# EAGLE design controller-board (EAGLE 7.1.0)
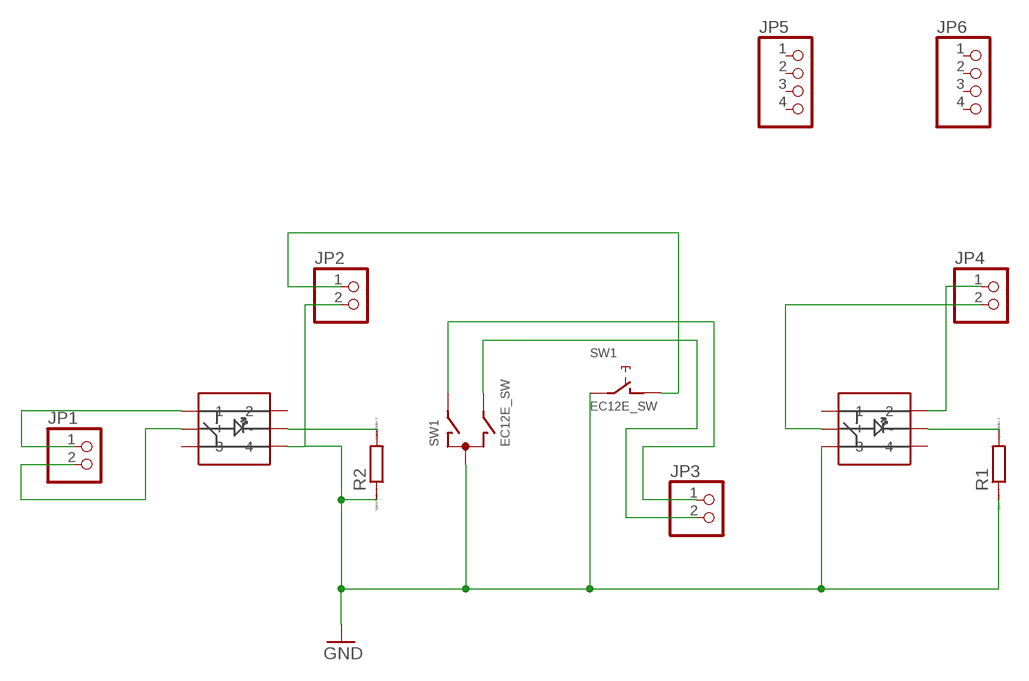
[diagram p0: schematic, sheet 1]

## Parts
BTN_MODE  PB614  [PB614]
BTN_OFF  PB614  [PB614]
JP1  PINHD-1X2  [1X02]
JP2  PINHD-1X2  [1X02]
JP3  PINHD-1X2  [1X02]
JP4  PINHD-1X2  [1X02]
JP5  PINHD-1X4  [1X04]
JP6  PINHD-1X4  [1X04]
R1  R-EU_R1206  [R1206]
R2  R-EU_R1206  [R1206]
SW1  EC12E_SW  [ALPS_EC12E_SW]

## Nets
GND: BTN_MODE.4 BTN_OFF.3 JP2.2 R1.1 R2.1 SW1.C SW1.E
LED_MODE: BTN_MODE.L+(+) JP1.2
N$1: BTN_MODE.L-(-) R2.2
N$2: BTN_OFF.L-(-) R1.2
N$3: JP2.1 SW1.D
N$4: JP3.2 SW1.B
N$5: JP3.1 SW1.A
N$6: BTN_OFF.L+(+) JP4.2
N$7: BTN_OFF.2 JP4.1
SW_MODE: BTN_MODE.1 JP1.1
Unconnected: BTN_MODE.2 BTN_MODE.3 BTN_OFF.1 BTN_OFF.4 JP5.1 JP5.2 JP5.3 JP5.4 JP6.1 JP6.2 JP6.3 JP6.4

## Library data of the parts
BTN_MODE BTN_OFF = RSJ-PB614:PB614
JP1-JP4 = pinhead:PINHD-1X2: PIN HEADER
JP5 JP6 = pinhead:PINHD-1X4: PIN HEADER
R1 R2 = resistor:R-EU_: RESISTOR, European symbol; SPICEPREFIX: R
SW1 = switch-alps:EC12E_SW: ALPS rotary Encoder EC12E series with switch; MPN: EC12E2424407; OC_FARNELL: 1520813; OC_NEWARK: 74M1068

## Board
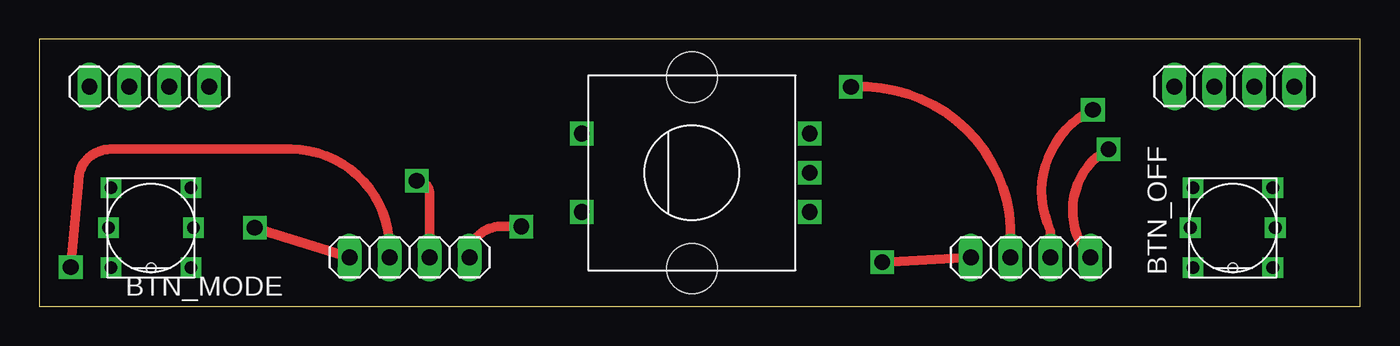
[diagram p1: board, top side]
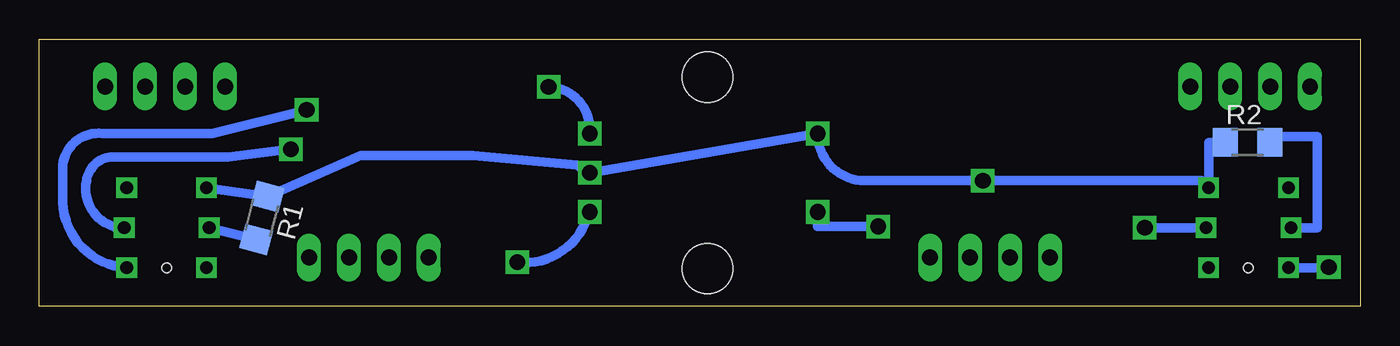
[diagram p2: board, bottom side, seen from below]

Size 84 x 17 mm. Coordinates in mm from the lower left corner, seen from the top.
Outline: 0,0 84,0 84,17 0,17 0,0
Copper layers (1*16): Top 0.035mm / dielectric 1.5mm / Bottom 0.035mm
Design rules "default": minimum track width 10mil, minimum drill 24mil, track to track 8mil, track to pad 8mil, pad to pad 8mil, via to via 8mil, smd to smd 8mil, copper to edge 40mil, drill to drill 8mil, minimum pad ring 10mil, minimum via ring 8mil, stop-mask expansion 4mil, vias tented up to drill 0mil, thermal gap 10mil

### Footprints (pad centres in the part's own frame; a part is rotated, then mirrored left to right if it is on the bottom)
PB614 = drill 0.8 square: 1 -2.54,2.54; 2 -2.54,-2.54; 3 2.54,2.54; 4 2.54,-2.54; L+ 0,-2.7; L- 0,2.7 | hole 0.6: -2.54,0
1X02 = drill 1.016 long: 1 -1.27,0; 2 1.27,0
1X04 = drill 1.016 long: 1 -3.81,0; 2 -1.27,0; 3 1.27,0; 4 3.81,0
R1206 = smd 1.6 x 1.803: 1 -1.422,0; 2 1.422,0
ALPS_EC12E_SW = drill 1 square: A -2.5,-7.5; B 2.5,-7.5; C 0,-7.5; D -2.5,7; E 2.5,7 | hole 3.2: -6.1,0; 6.1,0

### Placement (x,y rotation side)
BTN_MODE  7.1,5 90 top
BTN_OFF  75.9,5 90 top
JP1  21,3.1 180 top
JP2  26.08,3.1 180 top
JP3  60.5,3.1 0 top
JP4  65.58,3.1 0 top
JP5  7,14 0 top
JP6  76,14 0 top
R1  69.85,5.62 255 bottom
R2  7.16,10.43 0 bottom
SW1  41.5,8.5 90 top

### Tracks (layer width: path | path; a pad name or v marks a point on that pad's centre or on a via)
GND  (via drill 1)
  Top 0.61: v24,8 arc-90 24.81,7.19 JP2.2
  Bottom 0.61: R2.1 9.64,10.43 BTN_MODE.4 10.1,8 v24,8 31.5,8 arc90 SW1.E SW1.C | 49,8.89 SW1.C | SW1.C 49.81,9 56.42,9.61 63.56,9.61 R1.1 BTN_OFF.3
LED_MODE  (via drill 1)
  Top 0.61: v13.7,5 JP1.2
  Bottom 0.61: BTN_MODE.L+ v13.7,5
N$1
  Bottom 0.61: BTN_MODE.L- 2.71,5 2.71,10.79 5.74,10.79 R2.2
N$2
  Bottom 0.61: R1.2 BTN_OFF.L-
N$3  (via drill 1)
  Top 0.61: JP2.1 arc-90 29.33,5.08 v30.66,5.08
  Bottom 0.61: v30.66,5.08 34.5,5.08 SW1.D
N$4  (via drill 1)
  Top 0.61: v51.61,13.97 51.8,13.97 arc-90 61.77,5 JP3.2
  Bottom 0.61: SW1.B arc-90 51.47,13.97 v51.61,13.97
N$5  (via drill 1)
  Top 0.61: JP3.1 v53.61,2.81
  Bottom 0.61: SW1.A 49,6.42 arc90 v53.61,2.81
N$6  (via drill 1)
  Top 0.61: JP4.2 arc-90 67.25,9.5 v68,10
  Bottom 0.61: BTN_OFF.L+ 79,5 arc90 81,8 arc90 79,9.5 72,9.5 v68,10
N$7  (via drill 1)
  Top 0.61: v67,12.5 arc90 64.31,4.81 JP4.1
  Bottom 0.61: BTN_OFF.2 arc90 82.5,7.02 82.5,9 arc90 80,11 73,11 v67,12.5
SW_MODE  (via drill 1)
  Top 0.61: JP1.1 22.27,3.73 arc90 16,10 4.5,10 arc90 2.5,8 v2,2.5
  Bottom 0.61: BTN_MODE.1 2.5,2.46 v2,2.5